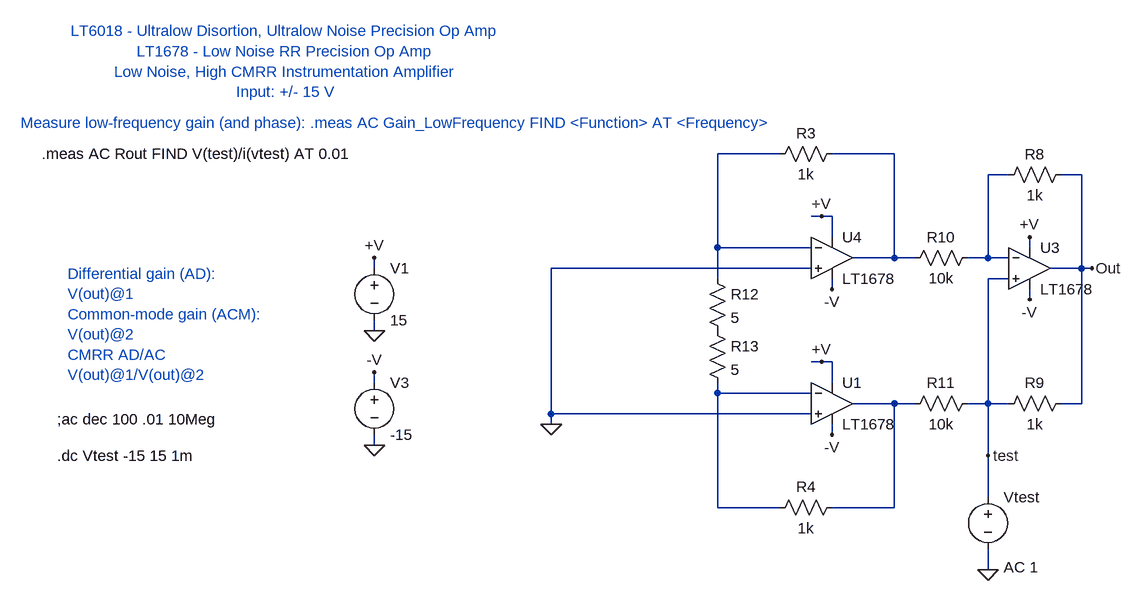
[diagram p0: schematic AI_VI_Howland_Rout.asc]
AI_VI_Howland_Rout.asc, the LTspice schematic file:
Version 4
SHEET 1 2004 1192
WIRE 416 48 320 48
WIRE 592 48 496 48
WIRE 768 80 736 80
WIRE 880 80 848 80
WIRE 480 144 464 144
WIRE 496 144 480 144
WIRE 496 176 496 144
WIRE 320 192 320 48
WIRE 464 192 320 192
WIRE 800 192 800 176
WIRE 592 208 592 48
WIRE 592 208 528 208
WIRE 624 208 592 208
WIRE 736 208 736 80
WIRE 736 208 704 208
WIRE 768 208 736 208
WIRE -208 224 -208 208
WIRE 464 224 64 224
WIRE 880 224 880 80
WIRE 880 224 832 224
WIRE 896 224 880 224
WIRE 320 240 320 192
WIRE 768 240 736 240
WIRE 496 256 496 240
WIRE 800 272 800 256
WIRE -208 320 -208 304
WIRE 480 368 464 368
WIRE 496 368 480 368
WIRE -208 400 -208 384
WIRE 496 400 496 368
WIRE 320 416 320 400
WIRE 464 416 320 416
WIRE 592 432 528 432
WIRE 624 432 592 432
WIRE 736 432 736 240
WIRE 736 432 704 432
WIRE 768 432 736 432
WIRE 880 432 880 224
WIRE 880 432 848 432
WIRE 64 448 64 224
WIRE 464 448 64 448
WIRE 64 464 64 448
WIRE 496 480 496 464
WIRE -208 496 -208 480
WIRE 736 512 736 432
WIRE 736 576 736 512
WIRE 320 592 320 416
WIRE 416 592 320 592
WIRE 592 592 592 432
WIRE 592 592 496 592
WIRE 736 688 736 656
FLAG -208 320 0
FLAG -208 496 0
FLAG -208 208 +V
FLAG -208 384 -V
FLAG 896 224 Out
FLAG 800 176 +V
FLAG 800 272 -V
FLAG 736 688 0
FLAG 64 464 0
FLAG 480 144 +V
FLAG 496 256 -V
FLAG 480 368 +V
FLAG 496 480 -V
FLAG 736 512 test
SYMBOL Opamps\\LT1678 800 224 R0
SYMATTR InstName U3
SYMBOL voltage -208 208 R0
WINDOW 123 0 0 Left 2
WINDOW 39 0 0 Left 2
SYMATTR InstName V1
SYMATTR Value 15
SYMBOL voltage -208 384 R0
WINDOW 123 0 0 Left 2
WINDOW 39 0 0 Left 2
SYMATTR InstName V3
SYMATTR Value -15
SYMBOL res 864 64 R90
WINDOW 0 0 56 VBottom 2
WINDOW 3 32 56 VTop 2
SYMATTR InstName R8
SYMATTR Value 1k
SYMATTR SpiceLine tol=1 pwr=0.1
SYMBOL res 864 416 R90
WINDOW 0 0 56 VBottom 2
WINDOW 3 32 56 VTop 2
SYMATTR InstName R9
SYMATTR Value 1k
SYMATTR SpiceLine tol=1 pwr=0.1
SYMBOL res 720 192 R90
WINDOW 0 0 56 VBottom 2
WINDOW 3 32 56 VTop 2
SYMATTR InstName R10
SYMATTR Value 10k
SYMATTR SpiceLine tol=1 pwr=0.1
SYMBOL res 720 416 R90
WINDOW 0 0 56 VBottom 2
WINDOW 3 32 56 VTop 2
SYMATTR InstName R11
SYMATTR Value 10k
SYMATTR SpiceLine tol=1 pwr=0.1
SYMBOL res 304 224 R0
SYMATTR InstName R12
SYMATTR Value 5
SYMATTR SpiceLine tol=1 pwr=0.1
SYMBOL res 304 304 R0
SYMATTR InstName R13
SYMATTR Value 5
SYMATTR SpiceLine tol=1 pwr=0.1
SYMBOL res 512 32 R90
WINDOW 0 0 56 VBottom 2
WINDOW 3 32 56 VTop 2
SYMATTR InstName R3
SYMATTR Value 1k
SYMATTR SpiceLine tol=1 pwr=0.1
SYMBOL res 512 576 R90
WINDOW 0 0 56 VBottom 2
WINDOW 3 32 56 VTop 2
SYMATTR InstName R4
SYMATTR Value 1k
SYMATTR SpiceLine tol=1 pwr=0.1
SYMBOL voltage 736 560 R0
WINDOW 123 24 124 Left 2
WINDOW 39 0 0 Left 2
SYMATTR Value2 AC 1
SYMATTR InstName Vtest
SYMATTR Value ""
SYMBOL Opamps\\LT1678 496 208 R0
SYMATTR InstName U4
SYMBOL Opamps\\LT1678 496 432 R0
SYMATTR InstName U1
TEXT -344 -32 Bottom 2 ;LT6018 - Ultralow Disortion, Ultralow Noise Precision Op Amp\nLT1678 - Low Noise RR Precision Op Amp\nLow Noise, High CMRR Instrumentation Amplifier\nInput: +/- 15 V
TEXT -696 456 Left 2 !;ac dec 100 .01 10Meg
TEXT -720 48 Left 2 !.meas AC Rout FIND V(test)/i(vtest) AT 0.01
TEXT -752 0 Left 2 ;Measure low-frequency gain (and phase): .meas AC Gain_LowFrequency FIND <Function> AT <Frequency>
TEXT -680 232 Left 2 ;Differential gain (AD):\nV(out)@1\nCommon-mode gain (ACM):\nV(out)@2\nCMRR AD/AC\nV(out)@1/V(out)@2
TEXT -696 512 Left 2 !.dc Vtest -15 15 1m

The netlist it stands for:
* AI_VI_Howland_Rout.asc
XU3 test N003 Out +V -V LT1678  ; pins In+ In- OUT V+ V-
V1 +V 0 15
V3 -V 0 -15
R8 Out N003 1k tol=1 pwr=0.1
R9 Out test 1k tol=1 pwr=0.1
R10 N003 N002 10k tol=1 pwr=0.1
R11 test N005 10k tol=1 pwr=0.1
R12 N001 P001 5 tol=1 pwr=0.1
R13 P001 N004 5 tol=1 pwr=0.1
R3 N002 N001 1k tol=1 pwr=0.1
R4 N005 N004 1k tol=1 pwr=0.1
Vtest test 0 AC 1
XU4 0 N001 N002 +V -V LT1678  ; pins In+ In- OUT V+ V-
XU1 0 N004 N005 +V -V LT1678  ; pins In+ In- OUT V+ V-
* LT6018 - Ultralow Disortion, Ultralow Noise Precision Op Amp
* LT1678 - Low Noise RR Precision Op Amp
* Low Noise, High CMRR Instrumentation Amplifier
* Input: +/- 15 V
;ac dec 100 .01 10Meg
.meas AC Rout FIND V(test)/i(vtest) AT 0.01
* Measure low-frequency gain (and phase): .meas AC Gain_LowFrequency FIND <Function> AT <Frequency>
* Differential gain (AD):
* V(out)@1
* Common-mode gain (ACM):
* V(out)@2
* CMRR AD/AC
* V(out)@1/V(out)@2
.dc Vtest -15 15 1m
.backanno
.end